# EAGLE schematic DeviceDOut8 (EAGLE 5.00)
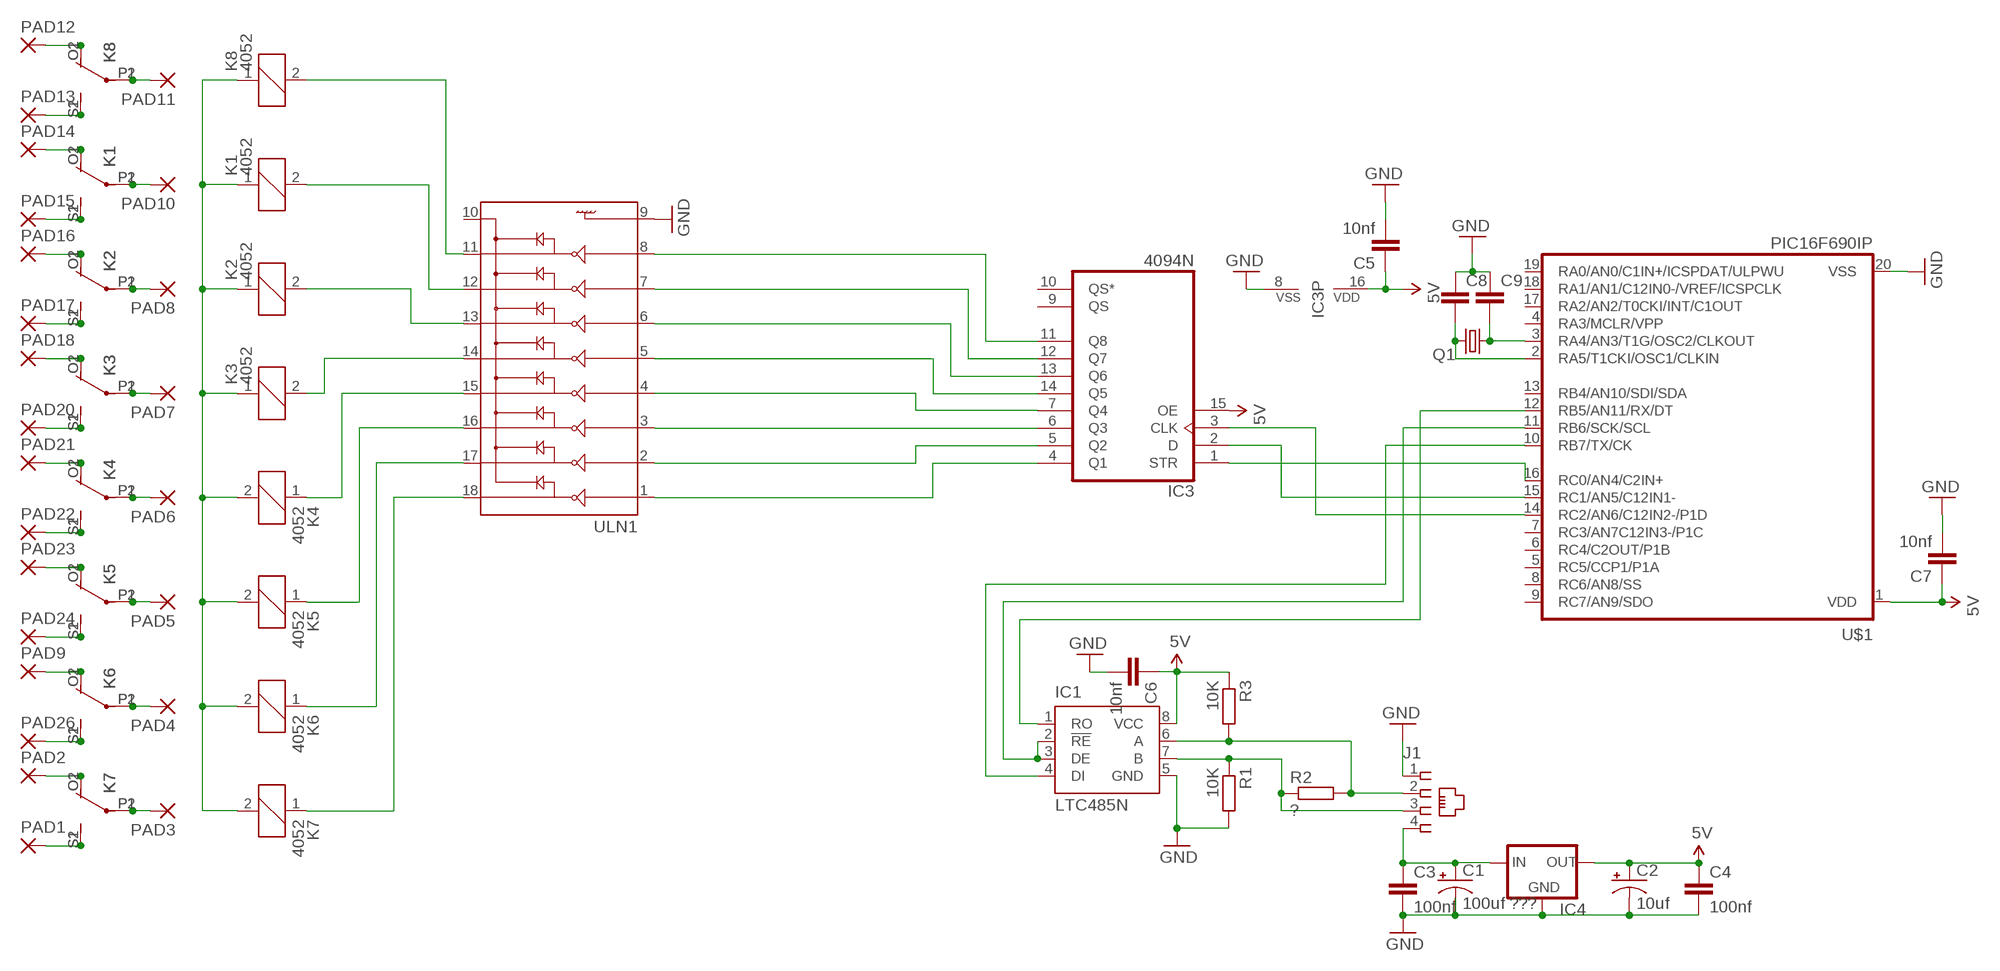
[diagram p0: schematic, sheet 1]

## Parts
C1  100uf ???  CAP_POLPTH1  [CPOL-RADIAL-100UF-25V]
C2  10uf  CAP_POLPTH1  [CPOL-RADIAL-100UF-25V]
C3  100nf  C2.5/2  [C2.5-2]
C4  100nf  C2.5/2  [C2.5-2]
C5  10nf  C2.5/2  [C2.5-2]
C6  10nf  C2.5/2  [C2.5-2]
C7  10nf  C2.5/2  [C2.5-2]
C8  C2.5/2  [C2.5-2]
C9  C2.5/2  [C2.5-2]
IC1  LTC485N  [DIL08]
IC3  4094N  [DIL16]
IC4  78XXS  [78XXS]
J1  215875-3  [215875-3]
K1  4052  [F4052]
K2  4052  [F4052]
K3  4052  [F4052]
K4  4052  [F4052]
K5  4052  [F4052]
K6  4052  [F4052]
K7  4052  [F4052]
K8  4052  [F4052]
PAD1  2,15/1,0  [2,15/1,0]
PAD2  2,15/1,0  [2,15/1,0]
PAD3  2,15/1,0  [2,15/1,0]
PAD4  2,15/1,0  [2,15/1,0]
PAD5  2,15/1,0  [2,15/1,0]
PAD6  2,15/1,0  [2,15/1,0]
PAD7  2,15/1,0  [2,15/1,0]
PAD8  2,15/1,0  [2,15/1,0]
PAD9  2,15/1,0  [2,15/1,0]
PAD10  2,15/1,0  [2,15/1,0]
PAD11  2,15/1,0  [2,15/1,0]
PAD12  2,15/1,0  [2,15/1,0]
PAD13  2,15/1,0  [2,15/1,0]
PAD14  2,15/1,0  [2,15/1,0]
PAD15  2,15/1,0  [2,15/1,0]
PAD16  2,15/1,0  [2,15/1,0]
PAD17  2,15/1,0  [2,15/1,0]
PAD18  2,15/1,0  [2,15/1,0]
PAD20  2,15/1,0  [2,15/1,0]
PAD21  2,15/1,0  [2,15/1,0]
PAD22  2,15/1,0  [2,15/1,0]
PAD23  2,15/1,0  [2,15/1,0]
PAD24  2,15/1,0  [2,15/1,0]
PAD26  2,15/1,0  [2,15/1,0]
Q1  CRYSTALHC49S  [HC49/S]
R1  10K  R-EU_0204/5  [0204/5]
R2  ?  R-EU_0204/5  [0204/5]
R3  10K  R-EU_0204/5  [0204/5]
U$1  PIC16F690IP  [DIL20]
ULN1  ULN2803DIP  [DIL18]

## Nets
5V: C2.1(+) C4.1 C5.1 C6.1 C7.1 IC1.8(VCC) IC3.15(OE) IC3.16(VDD) IC4.OUT R3.1 U$1.1(VDD)
GND: C1.2(-) C2.2(-) C3.2 C4.2 C5.2 C6.2 C7.2 C8.1 C9.1 IC1.5(GND) IC3.8(VSS) IC4.GND J1.1 R1.2 U$1.20(VSS) ULN1.9
N$1: K8.2 ULN1.11
N$2: K1.2 ULN1.12
N$3: K2.2 ULN1.13
N$4: K3.2 ULN1.14
N$5: K4.1 ULN1.15
N$6: K5.1 ULN1.16
N$7: K6.1 ULN1.17
N$8: K7.S1(2:S) K7.S2(3:S) PAD1.1(P)
N$9: K7.O1(2:O) K7.O2(3:O) PAD2.1(P)
N$10: IC3.4(Q1) ULN1.1
N$11: IC1.6(A) J1.2 R2.2 R3.2
N$12: IC3.5(Q2) ULN1.2
N$13: IC3.6(Q3) ULN1.3
N$14: IC3.7(Q4) ULN1.4
N$15: IC3.14(Q5) ULN1.5
N$16: IC3.13(Q6) ULN1.6
N$17: IC3.12(Q7) ULN1.7
N$18: IC3.11(Q8) ULN1.8
N$19: K7.P1(2:P) K7.P2(3:P) PAD3.1(P)
N$21: K1.1 K2.1 K3.1 K4.2 K5.2 K6.2 K7.2 K8.1
N$22: IC3.1(STR) U$1.16(RC0/AN4/C2IN+)
N$23: K6.P1(2:P) K6.P2(3:P) PAD4.1(P)
N$24: K7.1 ULN1.18
N$25: IC1.2(!RE) IC1.3(DE) U$1.11(RB6/SCK/SCL)
N$26: K5.P1(2:P) K5.P2(3:P) PAD5.1(P)
N$27: K4.P1(2:P) K4.P2(3:P) PAD6.1(P)
N$28: K2.P1(2:P) K2.P2(3:P) PAD8.1(P)
N$29: K1.P1(2:P) K1.P2(3:P) PAD10.1(P)
N$30: K8.P1(2:P) K8.P2(3:P) PAD11.1(P)
N$31: K8.O1(2:O) K8.O2(3:O) PAD12.1(P)
N$32: K8.S1(2:S) K8.S2(3:S) PAD13.1(P)
N$33: K1.S1(2:S) K1.S2(3:S) PAD15.1(P)
N$34: K2.O1(2:O) K2.O2(3:O) PAD16.1(P)
N$35: K2.S1(2:S) K2.S2(3:S) PAD17.1(P)
N$36: K3.O1(2:O) K3.O2(3:O) PAD18.1(P)
N$37: K3.S1(2:S) K3.S2(3:S) PAD20.1(P)
N$38: K6.O1(2:O) K6.O2(3:O) PAD9.1(P)
N$39: K6.S1(2:S) K6.S2(3:S) PAD26.1(P)
N$40: K1.O1(2:O) K1.O2(3:O) PAD14.1(P)
N$41: K4.O1(2:O) K4.O2(3:O) PAD21.1(P)
N$42: K4.S1(2:S) K4.S2(3:S) PAD22.1(P)
N$43: K5.O1(2:O) K5.O2(3:O) PAD23.1(P)
N$44: K5.S1(2:S) K5.S2(3:S) PAD24.1(P)
N$45: K3.P1(2:P) K3.P2(3:P) PAD7.1(P)
N$46: C1.1(+) C3.1 IC4.IN J1.4
N$47: IC3.2(D) U$1.15(RC1/AN5/C12IN1-)
N$48: IC3.3(CLK) U$1.14(RC2/AN6/C12IN2-/P1D)
N$49: IC1.4(DI) U$1.10(RB7/TX/CK)
N$50: IC1.7(B) J1.3 R1.1 R2.1
N$51: IC1.1(RO) U$1.12(RB5/AN11/RX/DT)
N$52: C8.2 Q1.2 U$1.2(RA5/T1CKI/OSC1/CLKIN)
N$53: C9.2 Q1.1 U$1.3(RA4/AN3/T1G/OSC2/CLKOUT)
Unconnected: IC3.9(QS) IC3.10(QS*) U$1.4(RA3/MCLR/VPP) U$1.5(RC5/CCP1/P1A) U$1.6(RC4/C2OUT/P1B) U$1.7(RC3/AN7C12IN3-/P1C) U$1.8(RC6/AN8/SS) U$1.9(RC7/AN9/SDO) U$1.13(RB4/AN10/SDI/SDA) U$1.17(RA2/AN2/T0CKI/INT/C1OUT) U$1.18(RA1/AN1/C12IN0-/VREF/ICSPCLK) U$1.19(RA0/AN0/C1IN+/ICSPDAT/ULPWU) ULN1.10

## Library data of the parts
C1 C2 = SparkFun:CAP_POL: Capacitor Polarized These are standard SMD and PTH capacitors. Normally 10uF, 47uF, and 100uF in electrolytic and tantalum varieties. Always verify the external diameter of the through hole cap, it varies with capacity, voltage, and manufacturer. The EIA devices should be standard.
C3-C9 = capacitor-wima:C: CAPACITOR naming: grid - package width
IC1 = linear-technology:LTC485: Low Power RS485 Interface Transceiver Source: http://www.linear.com/pc/downloadDocument.do?navId=H0,C1,C1007,C1017,P2064,D1718
IC3 = 40xx:4094: 8-stage SHIFT/STORE REGISTER, tri-state
IC4 = v-reg:78XXS: VOLTAGE REGULATOR
J1 = con-amp:215875-3: AMP connector
K1-K8 = relay:4052: RELAY 2 x switch, Finder
PAD1-PAD18 PAD20-PAD24 PAD26 = wirepad:2,15/1,0: THROUGH-HOLE PAD
Q1 = crystal:CRYSTAL: CRYSTAL
R1-R3 = resistor:R-EU_: RESISTOR, European symbol
U$1 = microchip-5:PIC16F690*: MICROCONTROLLER PIC16F690 18 I/O One 16-bit timer Two 8-bit timer Two comparators Precision internal oscillator-software selectable 8 MHz - 32 KHz SSP w/ I2C Compatible Address mask option EUSART LIN 2.0 Compatible ECCP+ w/ PWM Steering 12 A/D Channels ULPW Enhanced Low Power Timer 1 Timer 1 Gate Synch Latch 4k Program Flash memory 256 bytes SRAM 256 bytes EEPROM
ULN1 = SparkFun:ULN2803: Darlington Driver ULN2803 Darlington array. 500mA max per channel, 8-channel package. Spark Fun Electronics SKU : COM-00312